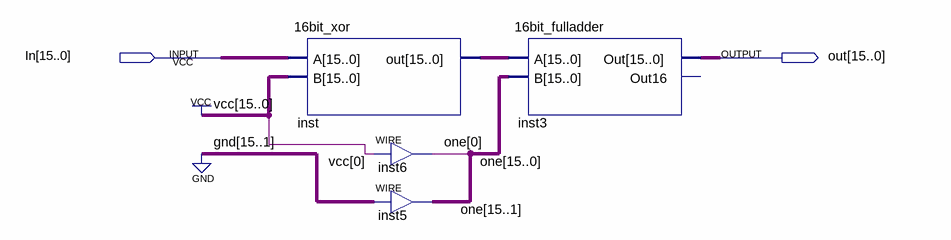
[diagram p0: schematic sheet]
// Quartus schematic 16bit_flipsign.bdf as structural Verilog: 4 symbols, 2 pins
module \16bit_flipsign  (
  input  [15:0] In,
  output [15:0] out
);

  wire [15:0] inst_out, one;

  \16bit_xor  inst (.A(In), .B({16{1'b1}}), .out(inst_out));
  assign one[0] = 1'b1;  // WIRE inst6
  assign one[15:1] = {15{1'b0}};  // WIRE inst5
  \16bit_fulladder  inst3 (.A(inst_out), .B(one), .Out(out));  // open: Out16
endmodule
